# Altium schematic sheet Master.SchDoc
size A; SheetNumber: 1; SheetTotal: 5
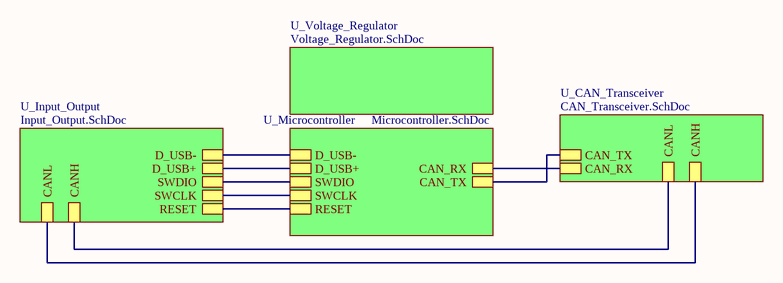
[diagram p0: Master.SchDoc]

## Sub-sheets
U_CAN_Transceiver = CAN_Transceiver.SchDoc: CANH, CANL, CAN_TX, CAN_RX
U_Input_Output = Input_Output.SchDoc: D_USB+, D_USB-, CANH, CANL, SWDIO, SWCLK, RESET
U_Microcontroller = Microcontroller.SchDoc: D_USB+, D_USB-, CAN_RX, CAN_TX, SWDIO, SWCLK, RESET
U_Voltage_Regulator = Voltage_Regulator.SchDoc: no entries

## Nets
(unnamed): sheet U_Input_Output/D_USB+, sheet U_Microcontroller/D_USB+
(unnamed): sheet U_Input_Output/D_USB-, sheet U_Microcontroller/D_USB-
(unnamed): sheet U_Input_Output/CANH, sheet U_CAN_Transceiver/CANL
(unnamed): sheet U_Input_Output/CANL, sheet U_CAN_Transceiver/CANH
(unnamed): sheet U_Input_Output/SWDIO, sheet U_Microcontroller/SWDIO
(unnamed): sheet U_Input_Output/SWCLK, sheet U_Microcontroller/SWCLK
(unnamed): sheet U_Input_Output/RESET, sheet U_Microcontroller/RESET
(unnamed): sheet U_Microcontroller/CAN_RX, sheet U_CAN_Transceiver/CAN_RX
(unnamed): sheet U_Microcontroller/CAN_TX, sheet U_CAN_Transceiver/CAN_TX